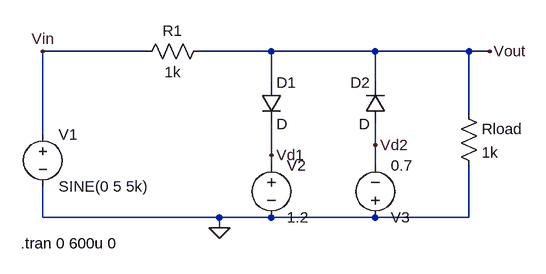
[diagram p0: schematic p7_prev1.asc]
p7_prev1.asc, the LTspice schematic file:
Version 4
SHEET 1 880 680
WIRE 64 32 -96 32
WIRE 256 32 144 32
WIRE 416 32 256 32
WIRE 560 32 416 32
WIRE 592 32 560 32
WIRE 256 80 256 32
WIRE 416 80 416 32
WIRE 560 128 560 32
WIRE -96 160 -96 32
WIRE 416 176 416 144
WIRE 256 192 256 144
WIRE 256 208 256 192
WIRE 416 208 416 176
WIRE -96 288 -96 240
WIRE 176 288 -96 288
WIRE 256 288 176 288
WIRE 416 288 256 288
WIRE 560 288 560 208
WIRE 560 288 416 288
WIRE 176 304 176 288
FLAG 176 304 0
FLAG 592 32 Vout
FLAG -96 32 Vin
FLAG 256 192 Vd1
FLAG 416 176 Vd2
SYMBOL voltage -96 144 R0
WINDOW 123 0 0 Left 0
WINDOW 39 0 0 Left 0
SYMATTR InstName V1
SYMATTR Value SINE(0 5 5k)
SYMBOL voltage 256 192 R0
WINDOW 123 0 0 Left 0
WINDOW 39 0 0 Left 0
SYMATTR InstName V2
SYMATTR Value 1.2
SYMBOL voltage 416 304 M180
WINDOW 123 0 0 Left 0
WINDOW 39 0 0 Left 0
SYMATTR InstName V3
SYMATTR Value 0.7
SYMBOL diode 240 80 R0
SYMATTR InstName D1
SYMBOL diode 432 144 R180
WINDOW 0 24 64 Left 2
WINDOW 3 24 0 Left 2
SYMATTR InstName D2
SYMBOL res 160 16 R90
WINDOW 0 0 56 VBottom 2
WINDOW 3 32 56 VTop 2
SYMATTR InstName R1
SYMATTR Value 1k
SYMBOL res 544 112 R0
SYMATTR InstName Rload
SYMATTR Value 1k
TEXT -130 328 Left 2 !.tran 0 600u 0

The netlist it stands for:
* p7_prev1.asc
V1 Vin 0 SINE(0 5 5k)
V2 Vd1 0 1.2
V3 0 Vd2 0.7
D1 Vout Vd1 D
D2 Vd2 Vout D
R1 Vout Vin 1k
Rload Vout 0 1k
.model D D
.lib standard.dio
.tran 0 600u 0
.backanno
.end

* Results of the author's LTspice run, read from the files saved beside the schematic
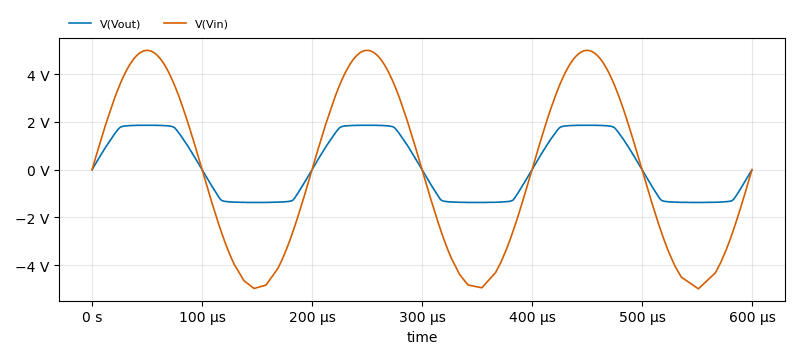
[diagram p1: Transient Analysis of p7_prev1.asc, plotted from the saved traces]
* Transient Analysis, 1 run:
*   V(Vout): min -1.376 V, max 1.861 V, average 134.8 mV, rms 1.358 V, last 0 V
*   V(Vin): min -4.994 V, max 5 V, average 10.51 mV, rms 3.525 V, last 0 V